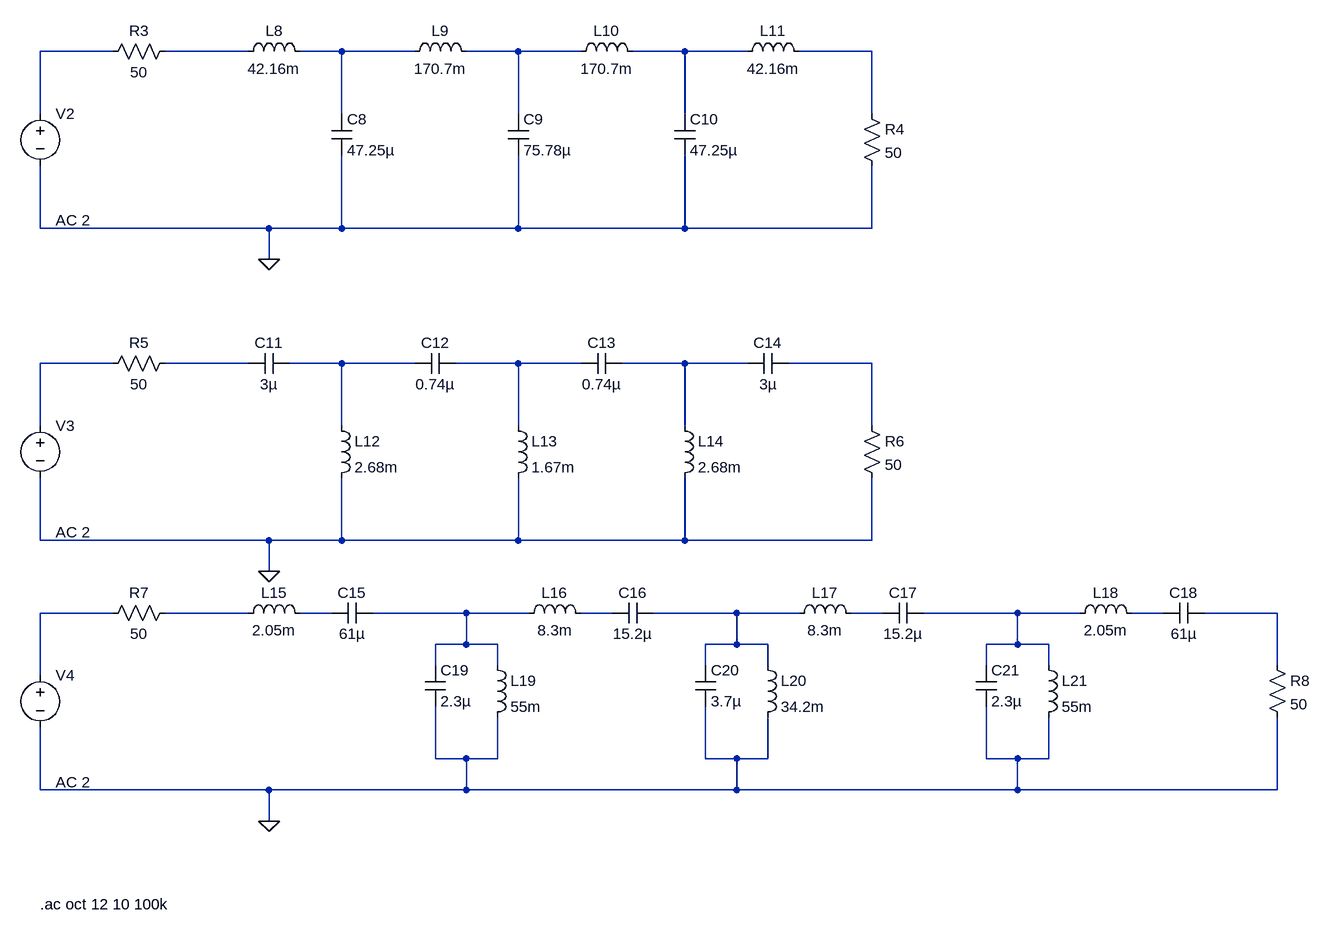
[diagram p0: schematic Draft4 All.asc]
Draft4 All.asc, the LTspice schematic file:
Version 4.1
SHEET 1 2088 736
WIRE 208 -1024 96 -1024
WIRE 416 -1024 288 -1024
WIRE 560 -1024 496 -1024
WIRE 672 -1024 560 -1024
WIRE 832 -1024 752 -1024
WIRE 928 -1024 832 -1024
WIRE 1088 -1024 1008 -1024
WIRE 1184 -1024 1088 -1024
WIRE 1376 -1024 1264 -1024
WIRE 96 -928 96 -1024
WIRE 560 -928 560 -1024
WIRE 832 -928 832 -1024
WIRE 1088 -928 1088 -1024
WIRE 1376 -928 1376 -1024
WIRE 96 -752 96 -848
WIRE 448 -752 96 -752
WIRE 560 -752 560 -864
WIRE 560 -752 448 -752
WIRE 832 -752 832 -864
WIRE 832 -752 560 -752
WIRE 1088 -752 1088 -864
WIRE 1088 -752 832 -752
WIRE 1376 -752 1376 -848
WIRE 1376 -752 1088 -752
WIRE 448 -704 448 -752
WIRE 208 -544 96 -544
WIRE 416 -544 288 -544
WIRE 560 -544 480 -544
WIRE 672 -544 560 -544
WIRE 832 -544 736 -544
WIRE 928 -544 832 -544
WIRE 1088 -544 992 -544
WIRE 1184 -544 1088 -544
WIRE 1376 -544 1248 -544
WIRE 96 -448 96 -544
WIRE 560 -448 560 -544
WIRE 832 -448 832 -544
WIRE 1088 -448 1088 -544
WIRE 1376 -448 1376 -544
WIRE 96 -272 96 -368
WIRE 448 -272 96 -272
WIRE 560 -272 560 -368
WIRE 560 -272 448 -272
WIRE 832 -272 832 -368
WIRE 832 -272 560 -272
WIRE 1088 -272 1088 -368
WIRE 1088 -272 832 -272
WIRE 1376 -272 1376 -368
WIRE 1376 -272 1088 -272
WIRE 448 -224 448 -272
WIRE 208 -160 96 -160
WIRE 416 -160 288 -160
WIRE 544 -160 496 -160
WIRE 752 -160 608 -160
WIRE 848 -160 752 -160
WIRE 976 -160 928 -160
WIRE 1168 -160 1040 -160
WIRE 1264 -160 1168 -160
WIRE 1392 -160 1344 -160
WIRE 1600 -160 1456 -160
WIRE 1696 -160 1600 -160
WIRE 1824 -160 1776 -160
WIRE 2000 -160 1888 -160
WIRE 752 -112 752 -160
WIRE 752 -112 704 -112
WIRE 800 -112 752 -112
WIRE 1168 -112 1168 -160
WIRE 1168 -112 1120 -112
WIRE 1216 -112 1168 -112
WIRE 1600 -112 1600 -160
WIRE 1600 -112 1552 -112
WIRE 1648 -112 1600 -112
WIRE 704 -80 704 -112
WIRE 800 -80 800 -112
WIRE 1120 -80 1120 -112
WIRE 1216 -80 1216 -112
WIRE 1552 -80 1552 -112
WIRE 1648 -80 1648 -112
WIRE 2000 -80 2000 -160
WIRE 96 -64 96 -160
WIRE 704 64 704 -16
WIRE 752 64 704 64
WIRE 800 64 800 0
WIRE 800 64 752 64
WIRE 1120 64 1120 -16
WIRE 1168 64 1120 64
WIRE 1216 64 1216 0
WIRE 1216 64 1168 64
WIRE 1552 64 1552 -16
WIRE 1600 64 1552 64
WIRE 1648 64 1648 0
WIRE 1648 64 1600 64
WIRE 96 112 96 16
WIRE 448 112 96 112
WIRE 752 112 752 64
WIRE 752 112 448 112
WIRE 1168 112 1168 64
WIRE 1168 112 752 112
WIRE 1600 112 1600 64
WIRE 1600 112 1168 112
WIRE 2000 112 2000 0
WIRE 2000 112 1600 112
WIRE 448 160 448 112
FLAG 448 -704 0
FLAG 448 -224 0
FLAG 448 160 0
SYMBOL voltage 96 -944 R0
WINDOW 3 24 152 Left 2
WINDOW 123 24 180 Left 2
WINDOW 39 0 0 Left 0
SYMATTR Value ""
SYMATTR Value2 AC 2
SYMATTR InstName V2
SYMBOL res 304 -1040 R90
WINDOW 0 0 56 VBottom 2
WINDOW 3 32 56 VTop 2
SYMATTR InstName R3
SYMATTR Value 50
SYMBOL res 1360 -944 R0
SYMATTR InstName R4
SYMATTR Value 50
SYMBOL ind 400 -1008 R270
WINDOW 0 32 56 VTop 2
WINDOW 3 5 56 VBottom 2
SYMATTR InstName L8
SYMATTR Value 42.16m
SYMBOL ind 656 -1008 R270
WINDOW 0 32 56 VTop 2
WINDOW 3 5 56 VBottom 2
SYMATTR InstName L9
SYMATTR Value 170.7m
SYMBOL ind 912 -1008 R270
WINDOW 0 32 56 VTop 2
WINDOW 3 5 56 VBottom 2
SYMATTR InstName L10
SYMATTR Value 170.7m
SYMBOL ind 1168 -1008 R270
WINDOW 0 32 56 VTop 2
WINDOW 3 5 56 VBottom 2
SYMATTR InstName L11
SYMATTR Value 42.16m
SYMBOL cap 544 -928 R0
SYMATTR InstName C8
SYMATTR Value 47.25µ
SYMBOL cap 816 -928 R0
SYMATTR InstName C9
SYMATTR Value 75.78µ
SYMBOL cap 1072 -928 R0
SYMATTR InstName C10
SYMATTR Value 47.25µ
SYMBOL voltage 96 -464 R0
WINDOW 3 24 152 Left 2
WINDOW 123 24 180 Left 2
WINDOW 39 0 0 Left 0
SYMATTR Value ""
SYMATTR Value2 AC 2
SYMATTR InstName V3
SYMBOL res 304 -560 R90
WINDOW 0 0 56 VBottom 2
WINDOW 3 32 56 VTop 2
SYMATTR InstName R5
SYMATTR Value 50
SYMBOL res 1360 -464 R0
SYMATTR InstName R6
SYMATTR Value 50
SYMBOL cap 480 -560 R90
WINDOW 0 0 32 VBottom 2
WINDOW 3 32 32 VTop 2
SYMATTR InstName C11
SYMATTR Value 3µ
SYMBOL cap 736 -560 R90
WINDOW 0 0 32 VBottom 2
WINDOW 3 32 32 VTop 2
SYMATTR InstName C12
SYMATTR Value 0.74µ
SYMBOL cap 992 -560 R90
WINDOW 0 0 32 VBottom 2
WINDOW 3 32 32 VTop 2
SYMATTR InstName C13
SYMATTR Value 0.74µ
SYMBOL cap 1248 -560 R90
WINDOW 0 0 32 VBottom 2
WINDOW 3 32 32 VTop 2
SYMATTR InstName C14
SYMATTR Value 3µ
SYMBOL ind 544 -464 R0
SYMATTR InstName L12
SYMATTR Value 2.68m
SYMBOL ind 816 -464 R0
SYMATTR InstName L13
SYMATTR Value 1.67m
SYMBOL ind 1072 -464 R0
SYMATTR InstName L14
SYMATTR Value 2.68m
SYMBOL voltage 96 -80 R0
WINDOW 3 24 152 Left 2
WINDOW 123 24 180 Left 2
WINDOW 39 0 0 Left 0
SYMATTR Value ""
SYMATTR Value2 AC 2
SYMATTR InstName V4
SYMBOL res 304 -176 R90
WINDOW 0 0 56 VBottom 2
WINDOW 3 32 56 VTop 2
SYMATTR InstName R7
SYMATTR Value 50
SYMBOL ind 400 -144 R270
WINDOW 0 32 56 VTop 2
WINDOW 3 5 56 VBottom 2
SYMATTR InstName L15
SYMATTR Value 2.05m
SYMBOL cap 608 -176 R90
WINDOW 0 0 32 VBottom 2
WINDOW 3 32 32 VTop 2
SYMATTR InstName C15
SYMATTR Value 61µ
SYMBOL cap 1040 -176 R90
WINDOW 0 0 32 VBottom 2
WINDOW 3 32 32 VTop 2
SYMATTR InstName C16
SYMATTR Value 15.2µ
SYMBOL cap 1456 -176 R90
WINDOW 0 0 32 VBottom 2
WINDOW 3 32 32 VTop 2
SYMATTR InstName C17
SYMATTR Value 15.2µ
SYMBOL cap 1888 -176 R90
WINDOW 0 0 32 VBottom 2
WINDOW 3 32 32 VTop 2
SYMATTR InstName C18
SYMATTR Value 61µ
SYMBOL ind 832 -144 R270
WINDOW 0 32 56 VTop 2
WINDOW 3 5 56 VBottom 2
SYMATTR InstName L16
SYMATTR Value 8.3m
SYMBOL ind 1248 -144 R270
WINDOW 0 32 56 VTop 2
WINDOW 3 5 56 VBottom 2
SYMATTR InstName L17
SYMATTR Value 8.3m
SYMBOL ind 1680 -144 R270
WINDOW 0 32 56 VTop 2
WINDOW 3 5 56 VBottom 2
SYMATTR InstName L18
SYMATTR Value 2.05m
SYMBOL ind 784 -96 R0
SYMATTR InstName L19
SYMATTR Value 55m
SYMBOL ind 1200 -96 R0
SYMATTR InstName L20
SYMATTR Value 34.2m
SYMBOL ind 1632 -96 R0
SYMATTR InstName L21
SYMATTR Value 55m
SYMBOL cap 688 -80 R0
SYMATTR InstName C19
SYMATTR Value 2.3µ
SYMBOL cap 1104 -80 R0
SYMATTR InstName C20
SYMATTR Value 3.7µ
SYMBOL cap 1536 -80 R0
SYMATTR InstName C21
SYMATTR Value 2.3µ
SYMBOL res 1984 -96 R0
SYMATTR InstName R8
SYMATTR Value 50
TEXT 96 288 Left 2 !.ac oct 12 10 100k

The netlist it stands for:
* Draft4 All.asc
V2 N001 0 AC 2
R3 N002 N001 50
R4 N006 0 50
L8 N002 N003 42.16m
L9 N003 N004 170.7m
L10 N004 N005 170.7m
L11 N005 N006 42.16m
C8 N003 0 47.25µ
C9 N004 0 75.78µ
C10 N005 0 47.25µ
V3 N007 0 AC 2
R5 N008 N007 50
R6 N012 0 50
C11 N009 N008 3µ
C12 N010 N009 0.74µ
C13 N011 N010 0.74µ
C14 N012 N011 3µ
L12 N009 0 2.68m
L13 N010 0 1.67m
L14 N011 0 2.68m
V4 N013 0 AC 2
R7 N014 N013 50
L15 N014 N015 2.05m
C15 N016 N015 61µ
C16 N018 N017 15.2µ
C17 N020 N019 15.2µ
C18 N022 N021 61µ
L16 N016 N017 8.3m
L17 N018 N019 8.3m
L18 N020 N021 2.05m
L19 N016 0 55m
L20 N018 0 34.2m
L21 N020 0 55m
C19 N016 0 2.3µ
C20 N018 0 3.7µ
C21 N020 0 2.3µ
R8 N022 0 50
.ac oct 12 10 100k
.backanno
.end